# EAGLE design Impedance_Measurement_System (EAGLE 9.6.2)
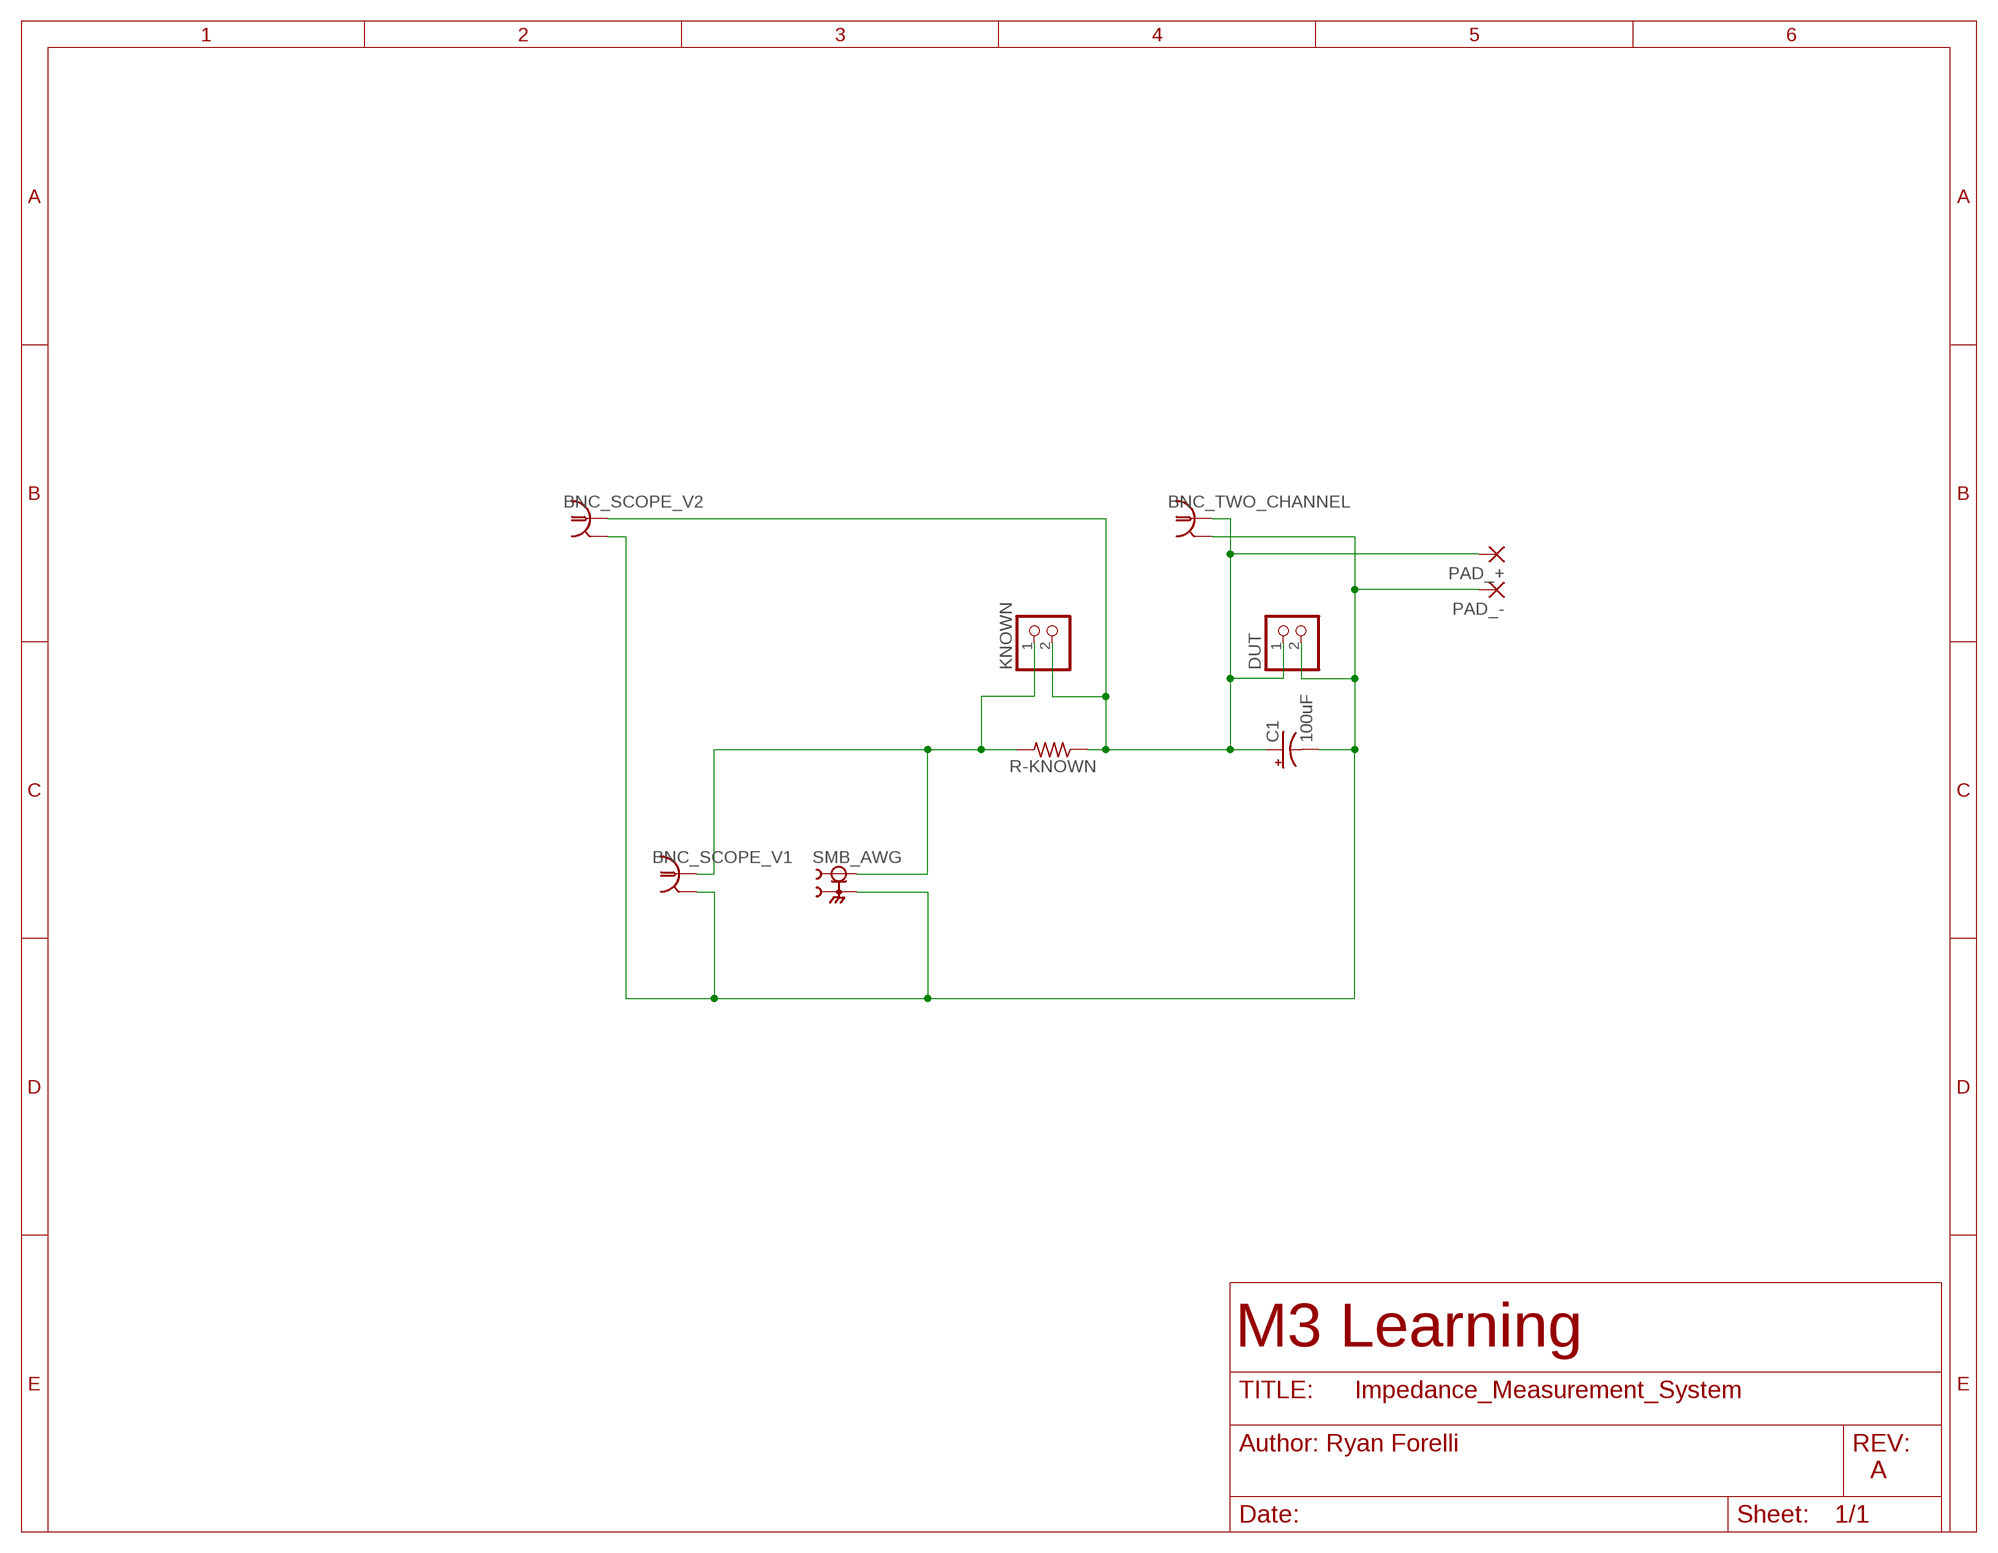
[diagram p0: schematic, sheet 1]

## Parts
BNC_SCOPE_V1  112404  [112404]
BNC_SCOPE_V2  112404  [112404]
BNC_TWO_CHANNEL  112404  [112404]
C1  100uF  10UF-POLAR-RADIAL-2.5MM-25V-20%  [CPOL-RADIAL-2.5MM-5MM]
DUT  PINHD-1X2  [1X02]
KNOWN  PINHD-1X2  [1X02]
PAD_+  SMD5  [SMD2,54-5,08]
PAD_-  SMD5  [SMD2,54-5,08]
R-KNOWN  10K  R-US_0204/7  [0204/7]
SMB_AWG  CONSMB006-G  [LINX_CONSMB006-G]

## Nets
N$1: BNC_SCOPE_V1.1 KNOWN.1 R-KNOWN.2 SMB_AWG.1
N$2: BNC_SCOPE_V1.2 BNC_SCOPE_V1.3 BNC_SCOPE_V1.4 BNC_SCOPE_V1.5 BNC_SCOPE_V2.2 BNC_SCOPE_V2.3 BNC_SCOPE_V2.4 BNC_SCOPE_V2.5 BNC_TWO_CHANNEL.2 BNC_TWO_CHANNEL.3 BNC_TWO_CHANNEL.4 BNC_TWO_CHANNEL.5 C1.2(-) DUT.2 PAD_-.1(P) SMB_AWG.G1 SMB_AWG.G2 SMB_AWG.G3 SMB_AWG.G4
N$3: BNC_SCOPE_V2.1 BNC_TWO_CHANNEL.1 C1.1(+) DUT.1 KNOWN.2 PAD_+.1(P) R-KNOWN.1

## Notes on the sheet
- M3 Learning
- A

## Library data of the parts
BNC_SCOPE_V1 BNC_SCOPE_V2 BNC_TWO_CHANNEL = 112404:112404: Amphenol Connex 112404 BNC P. C. Mount Recept. Jack Source: http://www.amphenolconnex.com/media/downloads/3157/112404.pdf Check prices <https://pricing.snapeda.com/parts/112404/Amphenol%20RF/view-part?ref=eda> Check prices <https://pricing.snapeda.com/parts/112404/Amphenol%20RF/view-part?ref=eda> Check prices <https://pricing.snapeda.com/parts/112404/Amphenol%20RF/view-part?ref=eda>; AVAILABILITY: In Stock; DESCRIPTION: BNC Connector Jack, Female Socket 50Ohm Through Hole Solder; MF: Amphenol RF; MP: 112404; PACKAGE: None; PRICE: None
C1 = SparkFun-Capacitors:10UF-POLAR: 10.0µF polarized capacitors A capacitor is a passive two-terminal electrical component used to store electrical energy temporarily in an electric field.; PROD_ID: CAP-08440; VALUE: 10uF
DUT KNOWN = pinhead:PINHD-1X2: PIN HEADER
PAD_+ PAD_- = wirepad:SMD5: SMD PAD
R-KNOWN = rcl:R-US_: RESISTOR, American symbol; SPICEPREFIX: R
SMB_AWG = CONSMB006-G:CONSMB006-G: SMB Plug (female socket) PCB through hole connector Check prices <https://pricing.snapeda.com/parts/CONSMB006-G/Linx%20Technologies%20Inc./view-part?ref=eda>; AVAILABILITY: In Stock; DESCRIPTION: SMB Connector Plug, Female Socket 50 Ohm Through Hole Solder; MF: Linx Technologies Inc.; MP: CONSMB006-G; PACKAGE: None; PRICE: None

## Board
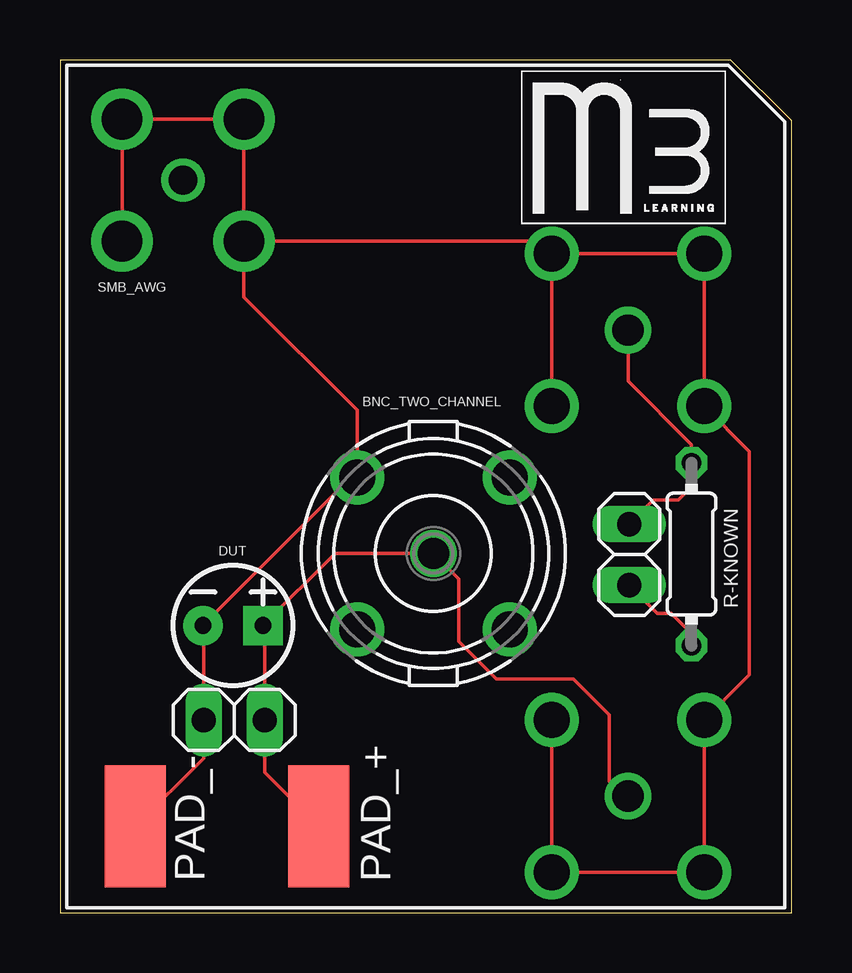
[diagram p1: board, top side]
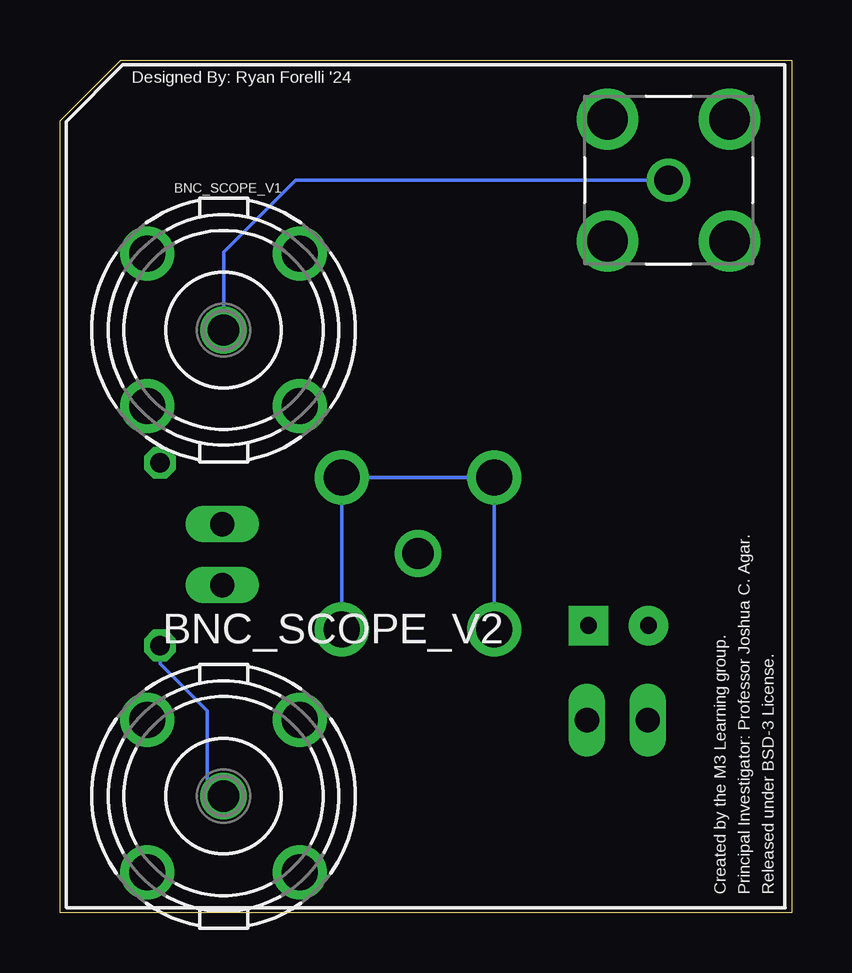
[diagram p2: board, bottom side, seen from below]

Size 30.48 x 35.56 mm. Coordinates in mm from the lower left corner, seen from the top.
Outline: 30.48,33.02 27.94,35.56 0,35.56 0,0 30.48,0 30.48,33.02
Copper layers (1*16): Top 0.035mm / dielectric 1.5mm / Bottom 0.035mm
Design rules "default": minimum track width 6mil, minimum drill 0.35mm, track to track 6mil, track to pad 6mil, pad to pad 6mil, via to via 6mil, smd to smd 6mil, copper to edge 40mil, drill to drill 6mil, minimum pad ring 10mil, minimum via ring 8mil, stop-mask expansion 4mil, vias tented up to drill 0mil, thermal gap 10mil

### Footprints (pad centres in the part's own frame; a part is rotated, then mirrored left to right if it is on the bottom)
112404 = drill 1.3: 1 0,0 | drill 1.5: 2 -3.175,3.175; 3 3.175,3.175; 4 3.175,-3.175; 5 -3.175,-3.175
CPOL-RADIAL-2.5MM-5MM = drill 0.7 pad 1.651 square: 1 1.25,0 | drill 0.7 pad 1.651: 2 -1.25,0
1X02 = drill 1.016 long: 1 -1.27,0; 2 1.27,0
SMD2,54-5,08 = smd 2.54 x 5.08: 1 0,0
0204/7 = drill 0.813 octagon: 1 -3.81,0; 2 3.81,0
LINX_CONSMB006-G = drill 1.2: 1 0,0 | drill 1.7: G1 2.54,2.54; G2 -2.54,2.54; G3 -2.54,-2.54; G4 2.54,-2.54

### Placement (x,y rotation side)
BNC_SCOPE_V1  23.67,24.3 0 bottom
BNC_SCOPE_V2  23.67,4.87 0 bottom
BNC_TWO_CHANNEL  15.56,14.99 0 top
C1  7.21,11.98 0 top
DUT  7.26,8.04 180 top
KNOWN  23.72,14.94 270 top
PAD_+  10.79,3.6 180 top
PAD_-  3.14,3.6 180 top
R-KNOWN  26.31,14.96 90 top
SMB_AWG  5.13,30.55 0 bottom

### Tracks (layer width: path | path; a pad name or v marks a point on that pad's centre or on a via)
N$1
  Top 0.152: KNOWN.1 24.72,17.21 25.77,17.21 26.31,17.75 R-KNOWN.2 26.31,19.52 23.67,22.17 BNC_SCOPE_V1.1
  Bottom 0.152: SMB_AWG.1 20.66,30.55 23.67,27.54 BNC_SCOPE_V1.1
N$2
  Top 0.152: PAD_-.1 5.99,6.45 DUT.2 5.99,11.95 C1.2 11.6,17.63 11.85,17.63 BNC_TWO_CHANNEL.2 12.38,20.96 7.67,25.68 SMB_AWG.G3 | SMB_AWG.G4 SMB_AWG.G1 SMB_AWG.G2 SMB_AWG.G3 | 20.49,27.34 BNC_SCOPE_V1.3 BNC_SCOPE_V1.2 BNC_SCOPE_V1.5 28.73,19.24 28.73,9.93 BNC_SCOPE_V2.2 BNC_SCOPE_V2.5 BNC_SCOPE_V2.4 BNC_SCOPE_V2.3 | 20.49,27.34 BNC_SCOPE_V1.4 | SMB_AWG.G3 19.82,28.01 20.49,27.34
  Bottom 0.152: BNC_TWO_CHANNEL.5 BNC_TWO_CHANNEL.2 BNC_TWO_CHANNEL.3 BNC_TWO_CHANNEL.4
N$3
  Top 0.152: PAD_+.1 8.53,5.86 DUT.1 8.53,11.91 C1.1 11.46,14.99 BNC_TWO_CHANNEL.1 16.61,13.93 16.61,11.32 18.18,9.75 21.38,9.75 22.89,8.25 22.89,5.49 23.5,4.87 BNC_SCOPE_V2.1 | KNOWN.2 24.89,12.5 25.46,12.5 26.31,11.65 R-KNOWN.1
  Bottom 0.152: R-KNOWN.1 26.31,10.37 24.35,8.41 24.35,5.56 BNC_SCOPE_V2.1

### Text on the board
tPlace: C:/Users/capta/Desktop/m3_newbord.bmp
bNames: Designed By: Ryan Forelli '24 | Released under BSD-3 License. | Principal Investigator: Professor Joshua C. Agar. | Created by the M3 Learning group.